# EAGLE design nrf24l01_r1 (EAGLE 7.4.0)
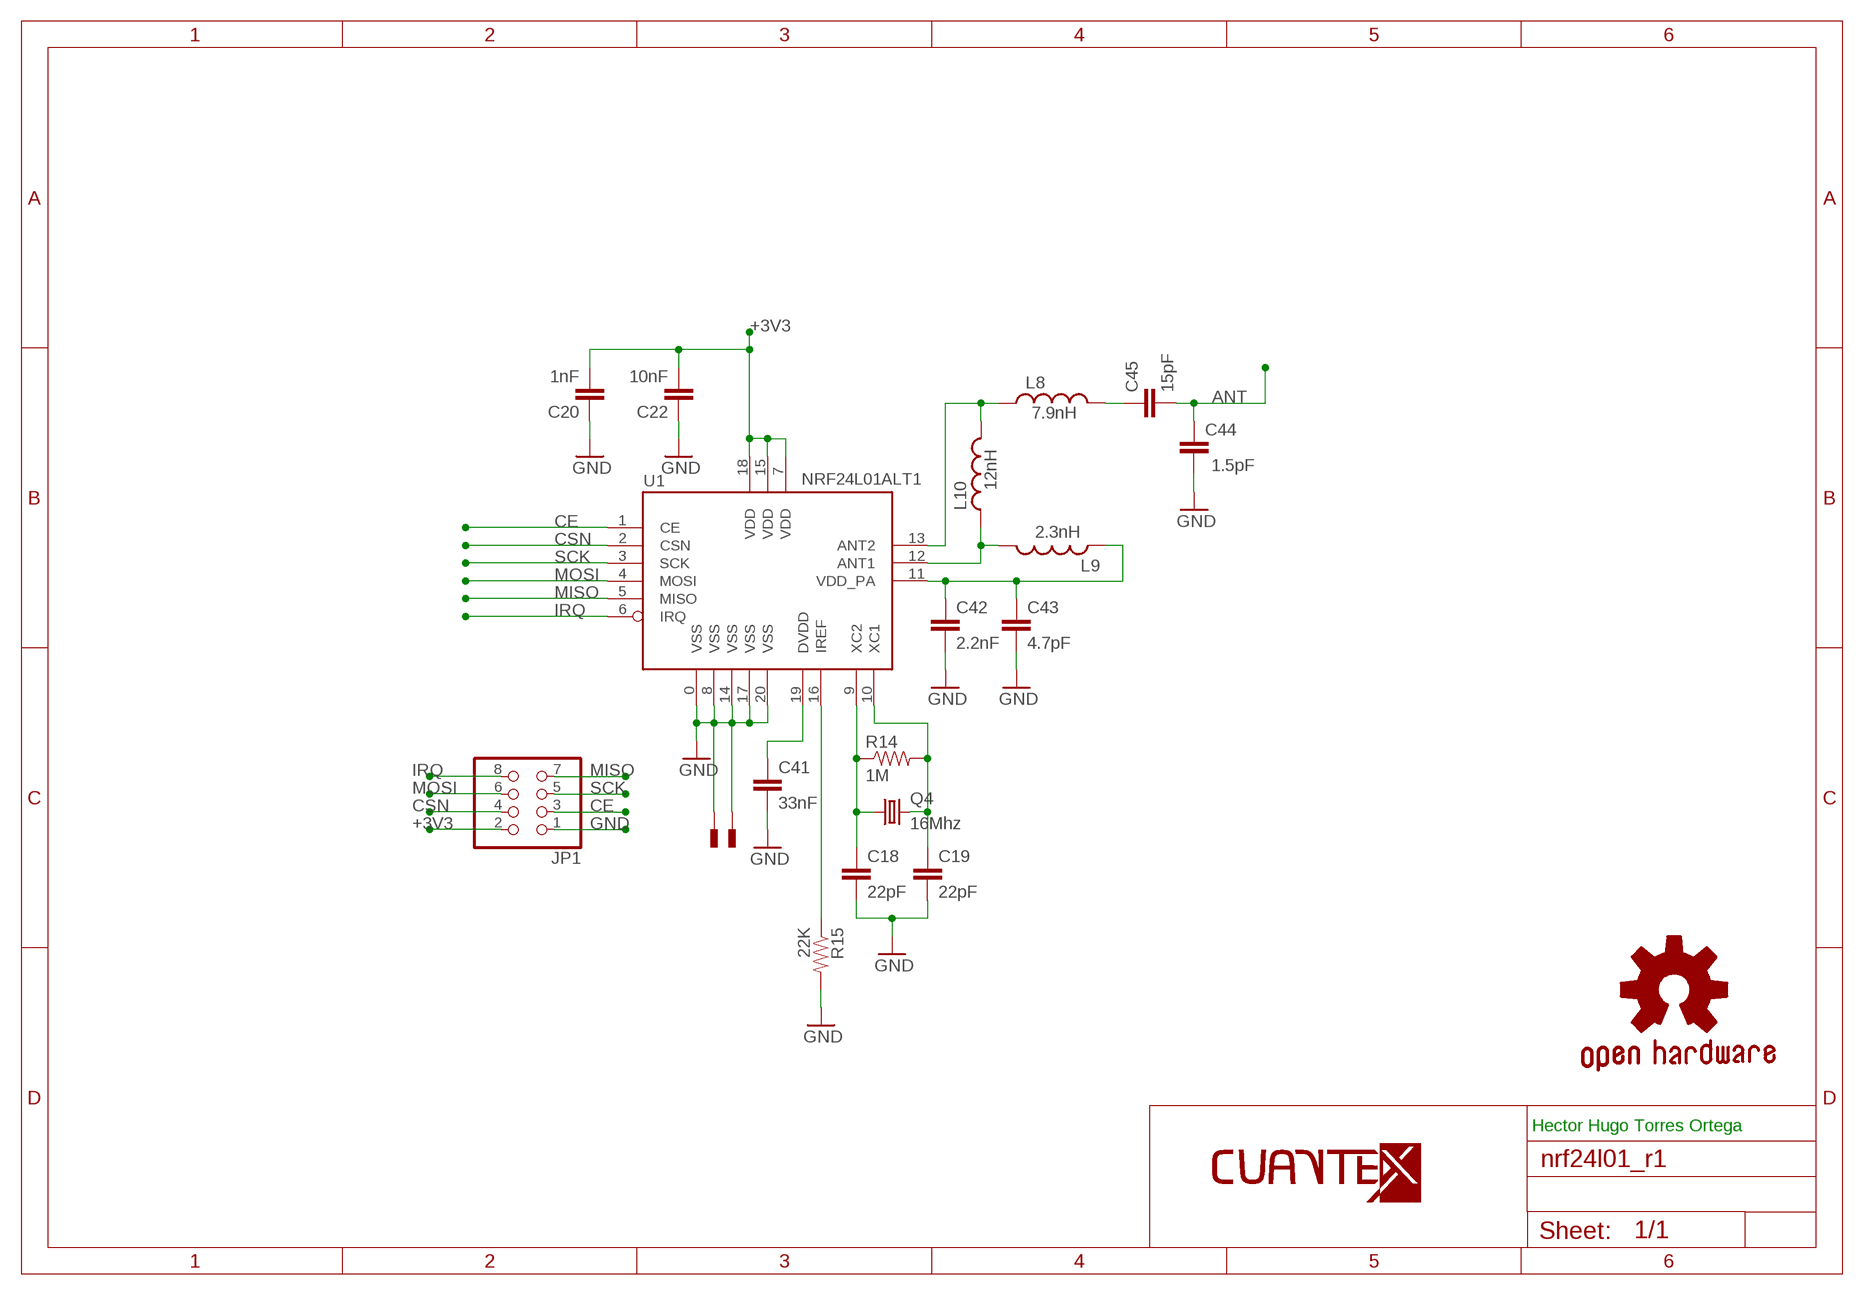
[diagram p0: schematic, sheet 1]

## Parts
C18  22pF  CAP0402-CAP  [0402-CAP]
C19  22pF  CAP0402-CAP  [0402-CAP]
C20  1nF  CAP0402-CAP  [0402-CAP]
C22  10nF  CAP0402-CAP  [0402-CAP]
C41  33nF  CAP0402-CAP  [0402-CAP]
C42  2.2nF  CAP0402-CAP  [0402-CAP]
C43  4.7pF  CAP0402-CAP  [0402-CAP]
C44  1.5pF  CAP0402-CAP  [0402-CAP]
C45  15pF  CAP0402-CAP  [0402-CAP]
GOLD_ORB_SM1  OSHWLOGO_GOLD_ORB_SM  [OSHW2]
JP1  PINHD-2X4  [2X04]
L8  7.9nH  INDUCTOR0402  [C0402]
L9  2.3nH  INDUCTOR0402  [C0402]
L10  12nH  INDUCTOR0402  [C0402]
Q4  16Mhz  CRYSTALHC49S  [HC49/S]
R14  1M  RESISTOR0402-RES  [0402-RES]
R15  22K  RESISTOR0402-RES  [0402-RES]
U1  NRF24L01ALT1  [QFN20_ALT1]
U$1  LOGO-BOT-20MM  [B-20]
U$9  PAD  [PAD-0.008]
U$10  PAD  [PAD-0.008]

## Nets
+3V3: C20.2 C22.2 JP1.2 U1.7(VDD) U1.15(VDD) U1.18(VDD)
ANT: C44.2 C45.2
CE: JP1.3 U1.1(CE)
CSN: JP1.4 U1.2(CSN)
GND: C18.2 C19.2 C20.1 C22.1 C41.2 C42.2 C43.2 C44.1 JP1.1 R15.2 U1.0(VSS) U1.8(VSS) U1.14(VSS) U1.17(VSS) U1.20(VSS) U$9.P$1 U$10.P$1
IRQ: JP1.8 U1.6(IRQ)
MISO: JP1.7 U1.5(MISO)
MOSI: JP1.6 U1.4(MOSI)
N$28: C18.1 Q4.1 R14.1 U1.9(XC2)
N$29: C19.1 Q4.2 R14.2 U1.10(XC1)
N$30: L8.1 L10.2 U1.13(ANT2)
N$31: C42.1 C43.1 L9.1 U1.11(VDD_PA)
N$32: R15.1 U1.16(IREF)
N$33: C41.1 U1.19(DVDD)
N$34: L9.2 L10.1 U1.12(ANT1)
N$35: C45.1 L8.2
SCK: JP1.5 U1.3(SCK)

## Notes on the sheet
- Hector Hugo Torres Ortega

## Library data of the parts
C18-C20 C22 C41-C45 = SparkFun:CAP: Capacitor Standard 0603 ceramic capacitor, and 0.1" leaded capacitor.
GOLD_ORB_SM1 = bfl:OSHWLOGO: These are Open-Source Hardware logos.
JP1 = pinhead:PINHD-2X4: PIN HEADER
L8-L10 = SparkFun:INDUCTOR: Inductors Basic Inductor/Choke - 0603 and 1206. Footprints are not proven and vary greatly between part numbers.
Q4 = crystal:CRYSTAL: CRYSTAL; OC_FARNELL: 1667008; OC_NEWARK: unknown
R14 R15 = SparkFun:RESISTOR: Resistor Basic schematic elements and footprints for 0603, 1206, and PTH resistors.
U1 = Testing:NRF24L01: 2.4GHz Low Power Transceiver This is the very popular, low cost, very low power RF transceiver from Nordic Semiconductor. Simple SPI interface. SKU: COM-00690
U$1 = LOGOTIPOS:LOGO-BOT-20MM
U$9 U$10 = Testing:PAD

## Board
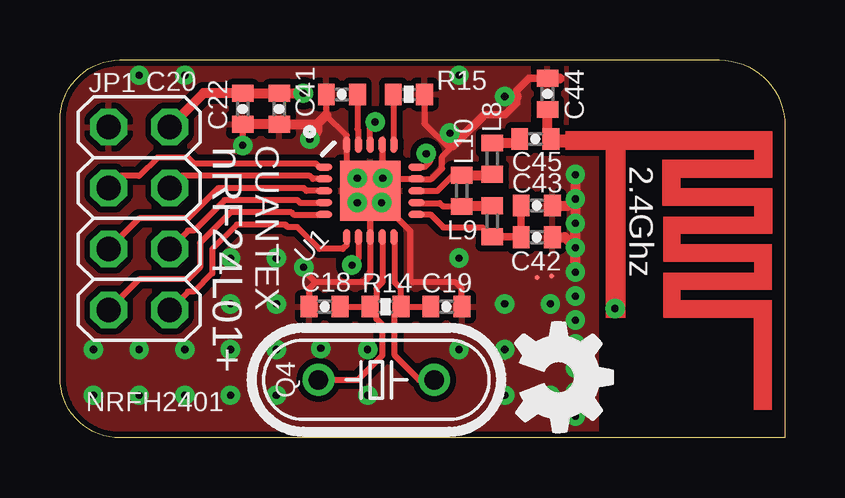
[diagram p1: board, top side]
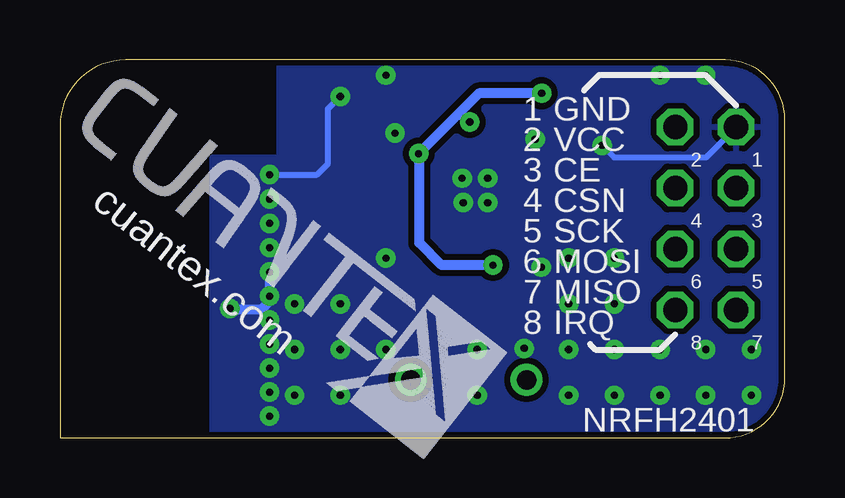
[diagram p2: board, bottom side, seen from below]

Size 30.23 x 15.75 mm. Coordinates in mm from the lower left corner, seen from the top.
Outline: 2.49,15.75 27.49,15.75 arc-90 30.23,13.01 30.23,0 2.5,0 arc-90 0,2.5 0,13.26 arc-90 2.49,15.75
Copper layers (1*16): Top 0.035mm / dielectric 1.5mm / Bottom 0.035mm
Design rules "cuantex2layerdrc": minimum track width 8mil, minimum drill 0.3mm, track to track 8mil, track to pad 8mil, pad to pad 8mil, via to via 8mil, smd to smd 8mil, copper to edge 10mil, drill to drill 10mil, minimum pad ring 10mil, minimum via ring 10mil, stop-mask expansion 4mil, vias tented up to drill 0mil, thermal gap 10mil

### Footprints (pad centres in the part's own frame; a part is rotated, then mirrored left to right if it is on the bottom)
0402-CAP = smd 0.7 x 0.9: 1 -0.65,0; 2 0.65,0
2X04 = drill 1.016 octagon: 1 -3.81,-1.27; 2 -3.81,1.27; 3 -1.27,-1.27; 4 -1.27,1.27; 5 1.27,-1.27; 6 1.27,1.27; 7 3.81,-1.27; 8 3.81,1.27
C0402 = smd 0.7 x 0.9: 1 -0.65,0; 2 0.65,0
HC49/S = drill 0.813: 1 -2.413,0; 2 2.413,0
0402-RES = smd 0.7 x 0.9: 1 -0.65,0; 2 0.65,0
QFN20_ALT1 = smd 2.515 x 2.515: 0 0,0 | smd 0.686 x 0.293: 1 -1.925,0.986; 2 -1.925,0.493; 3 -1.925,0; 4 -1.925,-0.493; 5 -1.925,-0.986; 11 1.925,-0.986; 12 1.925,-0.493; 13 1.925,0; 14 1.925,0.493; 15 1.925,0.986 | smd 0.293 x 0.686: 6 -0.986,-1.925; 7 -0.493,-1.925; 8 0,-1.925; 9 0.493,-1.925; 10 0.986,-1.925; 16 0.986,1.925; 17 0.493,1.925; 18 0,1.925; 19 -0.493,1.925; 20 -0.986,1.925
PAD-0.008 = smd 0.203 x 0.203: P$1 0,0

### Placement (x,y rotation side)
C18  11.03,5.47 180 top
C19  16.11,5.47 0 top
C20  7.62,13.72 90 top
C22  9.14,13.72 90 top
C41  11.75,14.32 180 top
C42  19.88,8.36 0 top
C43  19.88,9.69 0 top
C44  20.33,14.34 270 top
C45  19.82,12.46 0 top
GOLD_ORB_SM1  16.51,6.35 270 top
JP1  3.3,9.14 270 top
L8  18.02,11.64 90 top
L9  18.02,9.03 90 top
L10  16.75,10.3 90 top
Q4  13.19,2.42 0 top
R14  13.57,5.47 0 top
R15  14.55,14.32 0 top
U1  12.94,10.3 0 top
U$1  15.08,-0.93 38 top
U$9  20.51,6.74 180 top
U$10  19.9,6.69 180 top

### Tracks (layer width: path | path; a pad name or v marks a point on that pad's centre or on a via)
+3V3  (via drill 0.3)
  Top 0.254: U1.18 12.94,12.96 v13.14,13.17 | v15.27,11.85 15.43,11.69 15.43,11.52 15.19,11.28 U1.15 | U1.7 12.44,7.47 v12.17,7.2
  Top 0.406: v10.14,14.36 v10.14,14.37 C22.2 C20.2 5.98,14.37 JP1.2
  Bottom 0.406: v10.14,14.36 12.76,14.36 13.56,13.56 | 13.56,13.56 v15.27,11.85 15.24,11.81 15.24,8.13 14.31,7.2 v12.17,7.2 | v13.14,13.17 13.17,13.17 13.56,13.56
ANT
  Top 0.406: C45.2 21.84,12.46 21.84,12.45 21.89,12.45 21.89,12.29 20.33,12.29 C44.2
CE
  Top 0.254: JP1.3 2.54,10.92 3.3,10.92 4.06,11.68 5.33,11.68 5.59,11.43 10.67,11.43 10.81,11.28 U1.1
CSN
  Top 0.254: JP1.4 5.08,10.92 10.41,10.92 10.55,10.79 U1.2
GND  (via drill 0.3)
  Top 0.254: 10.65,6.49 12.68,6.49 12.94,6.74 U1.8 12.94,9.31 13.04,9.41 | 10.65,6.49 10.38,6.22 C18.2 | C19.2 16.75,5.49 16.75,6.23 16.49,6.49 14.71,6.49 14.61,6.59 14.61,8.62 13.85,9.38 13.85,9.41 13.04,9.41 | U1.17 13.44,12.21 13.44,11.03 12.94,10.53 U1.0 | 11.95,11.29 U1.20 11.95,12.6 11.1,13.45 C41.2 | 11.95,11.29 11.94,11.28 | U1.0 13.44,10.8 13.82,10.8 13.84,10.79 U1.14 15.48,10.78 15.93,11.24 15.93,11.72 16.26,12.04 | 11.95,11.29 U1.0 | 13.04,9.41 12.94,9.51 | 12.94,9.51 U1.0 | 16.26,12.04 16.37,12.15 | R15.2 15.2,13.1 16.26,12.04 | v12.39,9.8 v12.39,10.82 12.41,10.82 U1.0 | 12.94,9.51 13.12,9.51 v13.41,9.8 | C20.1 v7.62,12.19 | 21.57,6.82 v21.49,6.91 | 10.65,6.49 10.16,6.98 v10.16,7.11
  Top 0.305: 17.62,13.41 17.68,13.46 18.54,13.46 19.05,13.97 19.05,14.22 19.05,14.48 19.56,14.99 C44.1
  Top 0.356: 17.62,13.41 16.71,12.5 16.37,12.15
  Top 0.406: 10.72,13.07 C22.1 C20.1 | 10.72,13.07 11.1,13.45 | C44.1 20.83,14.99 | 20.83,14.99 | 10.72,13.07 10.72,12.75 v10.41,12.45 | v18.54,14.22 19.05,14.22 | v16.26,12.7 16.51,12.7 16.71,12.5 | v21.49,10.97 v21.49,9.96 | v21.49,9.96 v21.49,8.94 v21.49,7.93 | v21.49,6.91 v21.49,7.93 | C42.2 21.05,8.36 v21.49,7.93 | C43.2 21.22,9.69 v21.49,9.96
  Bottom 0.254: v21.49,10.97 19.51,10.97 19.05,11.43 19.05,13.72 v18.54,14.22 | JP1.1 3.3,11.68 7.11,11.68 v7.62,12.19
  Bottom 0.406: v21.49,6.91 21.49,5.69 21.84,5.33 23.08,5.33 v23.14,5.4
  other vias: 13.46,10.82 1.4,3.68 1.4,1.78 3.3,1.78 3.3,3.68 5.21,3.68 5.21,1.78 7.11,1.78 7.11,3.68 7.11,5.59 7.11,7.49 9.02,7.49 9.02,5.59 9.02,3.68 9.02,1.78 12.83,1.78 12.83,3.68 10.87,3.73 16.64,3.68 18.54,3.68 18.54,1.78 20.45,1.78 20.45,3.68 20.45,5.59 18.54,5.59 16.64,7.49 16.64,15.11 5.21,15.11 3.3,15.11 21.49,5.91 21.49,4.91 21.49,3.91 21.49,2.91 21.49,1.91 21.49,0.91
  pour Top (isolate 0.254): 0,15.75 21.08,15.75 21.08,11.68 22.35,11.68 22.35,0 0,0
  pour Bottom (isolate 0.254): 0,15.75 21.08,15.75 21.08,11.68 23.88,11.68 23.88,0 0,0
IRQ
  Top 0.254: U1.6 11.95,8.04 11.79,7.87 10.82,7.87 9.91,8.79 9.5,8.79 9.4,8.89 7.37,8.89 6.35,7.87 6.35,6.86 5.59,6.1 5.33,6.1 JP1.8
MISO
  Top 0.254: U1.5 10.98,9.28 9.77,9.28 9.65,9.4 7.11,9.4 5.84,8.13 5.84,7.11 5.33,6.6 3.3,6.6 JP1.7
MOSI
  Top 0.254: U1.4 11,9.79 10.02,9.79 9.91,9.91 6.86,9.91 5.59,8.64 5.33,8.64 JP1.6
N$28
  Top 0.254: U1.9 13.44,8.36 13.44,6.49 13.19,6.23 13.19,5.74 R14.1 | Q4.1 12.43,2.42 13.44,3.44 13.44,4.71 13.19,4.96 13.19,5.2 R14.1 | C18.1 R14.1
N$29
  Top 0.254: U1.10 13.95,8.34 13.95,6.49 14.21,6.23 14.21,5.49 R14.2 | Q4.2 14.97,2.42 13.95,3.44 13.95,5.2 R14.2 | R14.2 C19.1
N$30
  Top 0.254: U1.13 15.73,10.3 16.38,10.95 L10.2
  Top 0.406: 16.76,10.93 L10.2 18.02,10.95 L8.1
N$31
  Top 0.254: U1.11 15.45,9.31 15.98,8.77 17.62,8.77 L9.1
  Top 0.305: C43.1 C42.1 19.21,8.38 L9.1
N$32
  Top 0.254: R15.1 13.9,12.25 U1.16
N$33
  Top 0.254: U1.19 12.43,12.24 12.43,12.84 12.4,12.86 C41.1
N$34
  Top 0.254: U1.12 14.88,9.79 15.83,9.79 15.97,9.65 L10.1
  Top 0.406: L9.2 17.99,9.65 L10.1
N$35
  Top 0.406: L8.2 19.17,12.29 C45.1
SCK
  Top 0.254: JP1.5 3.3,9.14 5.33,9.14 6.6,10.41 10.16,10.41 10.28,10.3 U1.3
(copper drawn outside any net)
  shapes: Top area x15

### Text on the board
tPlace: nRF24L01+ | CUANTEX | 2.4Ghz | NRFH2401
bPlace: GND | 1 | 1 | 2 | VCC | 2 | CE | 3 | CSN | 4 | cuantex.com | 3 | 4 | SCK | 5 | MOSI | 6 | 5 | 6 | MISO | 7 | IRQ | 8 | 7 | 8 | NRFH2401